# Altium schematic sheet Block Diagram.SchDoc
size A3; ApprovedBy: UDEMY; CheckedBy: Öğrenciler; Revision: AA; SheetNumber: 2; SheetTotal: 6; PageSize: A3; Change Date: 15/09/2023; Rel Date: 15/09/2023; Department: R&D-Hardware; Prepared By: Ali ALCAN; ProjectDescription: Wireless Security Detector
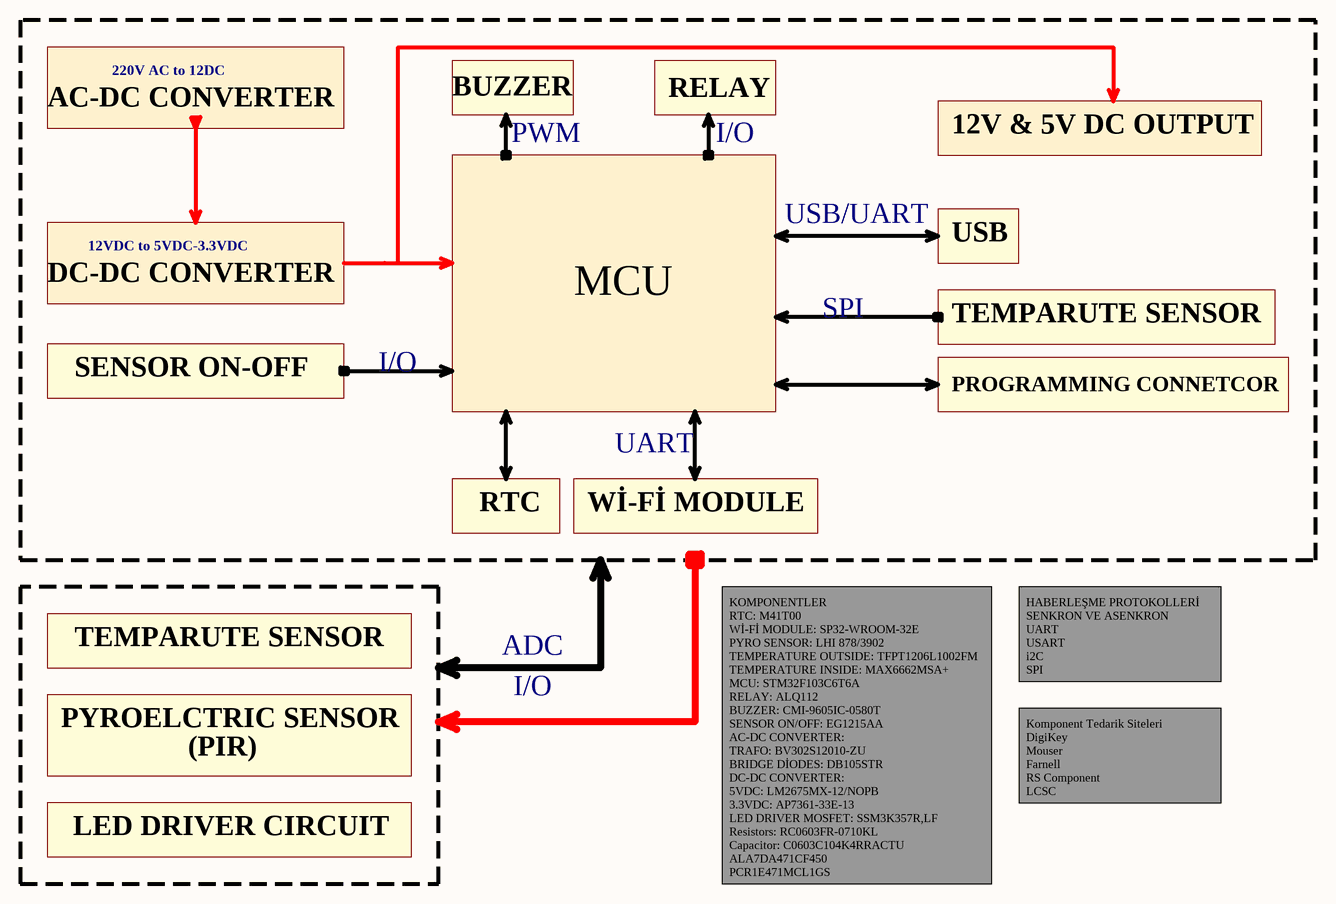
[diagram p0: Block Diagram.SchDoc]

## Notes on the sheet
- 220V AC to 12DC
- AC-DC CONVERTER
- BUZZER
- PWM
- RELAY
- I/O
- 12V & 5V DC OUTPUT
- USB/UART
- 12VDC to 5VDC-3.3VDC
- USB
- DC-DC CONVERTER
- MCU
- SPI
- TEMPARUTE SENSOR
- SENSOR ON-OFF
- PROGRAMMING CONNETCOR
- UART
- RTC
- Wİ-Fİ MODULE
- ADC
- HABERLEŞME PROTOKOLLERİ                               SENKRON VE ASENKRON                                                                                      UART                                                      USART                                                   i2C
  SPI
- PYROELCTRIC SENSOR
- (PIR)
- Komponent Tedarik Siteleri
  DigiKey
  Mouser
  Farnell
  RS Component
  LCSC
- LED DRIVER CIRCUIT
- KOMPONENTLER
  RTC: M41T00
  Wİ-Fİ MODULE: SP32-WROOM-32E
  PYRO SENSOR: LHI 878/3902
  TEMPERATURE OUTSIDE: TFPT1206L1002FM
  TEMPERATURE INSIDE: MAX6662MSA+
  MCU: STM32F103C6T6A
  RELAY: ALQ112
  BUZZER: CMI-9605IC-0580T
  SENSOR ON/OFF: EG1215AA
  AC-DC CONVERTER:
  TRAFO: BV302S12010-ZU
  BRIDGE DİODES: DB105STR
  DC-DC CONVERTER:
  5VDC: LM2675MX-12/NOPB
  3.3VDC: AP7361-33E-13
  LED DRIVER MOSFET: SSM3K357R,LF
  Resistors: RC0603FR-0710KL
  Capacitor: C0603C104K4RRACTU
  ALA7DA471CF450
  PCR1E471MCL1GS
- DocumentName
- Description
- Prepared By
- Rel Date
- Checked By
- Approved By
- Department
- Size
- Revision
- Change Date
- Sheet